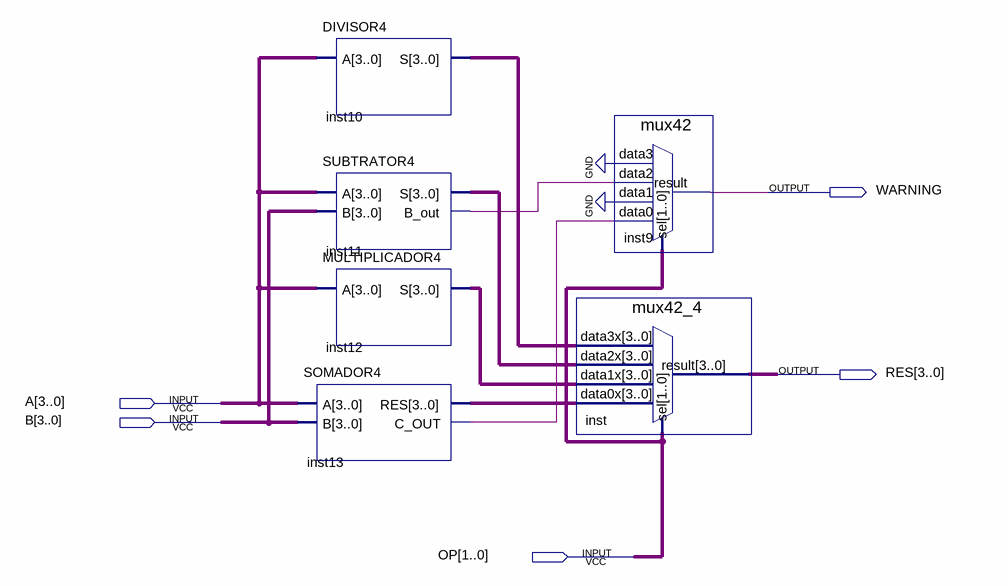
[diagram p0: schematic sheet]
// Quartus schematic ULA.bdf as structural Verilog: 6 symbols, 5 pins
module ULA (
  input  [3:0] A,
  input  [3:0] B,
  input  [1:0] OP,
  output WARNING,
  output [3:0] RES
);

  wire inst11_b_out, inst13_c_out;
  wire [3:0] inst10_s, inst11_s, inst12_s, inst13_res;

  SOMADOR4 inst13 (.A(A), .B(B), .RES(inst13_res), .C_OUT(inst13_c_out));
  DIVISOR4 inst10 (.A(A), .S(inst10_s));
  SUBTRATOR4 inst11 (.A(A), .B(B), .S(inst11_s), .B_out(inst11_b_out));
  MULTIPLICADOR4 inst12 (.A(A), .S(inst12_s));
  mux42 inst9 (.data3(1'b0), .data2(inst11_b_out), .data1(1'b0), .data0(inst13_c_out), .sel(OP), .result(WARNING));
  mux42_4 inst (.data3x(inst10_s), .data2x(inst11_s), .data1x(inst12_s), .data0x(inst13_res), .sel(OP), .result(RES));
endmodule
